# Altium schematic sheet Title Page.SchDoc: Title Page
size 431 x 279 mm; DocumentNumber: GHL-1-21002; Revision: C; SheetNumber: 1; SheetTotal: 7; ProjectID: 263-03
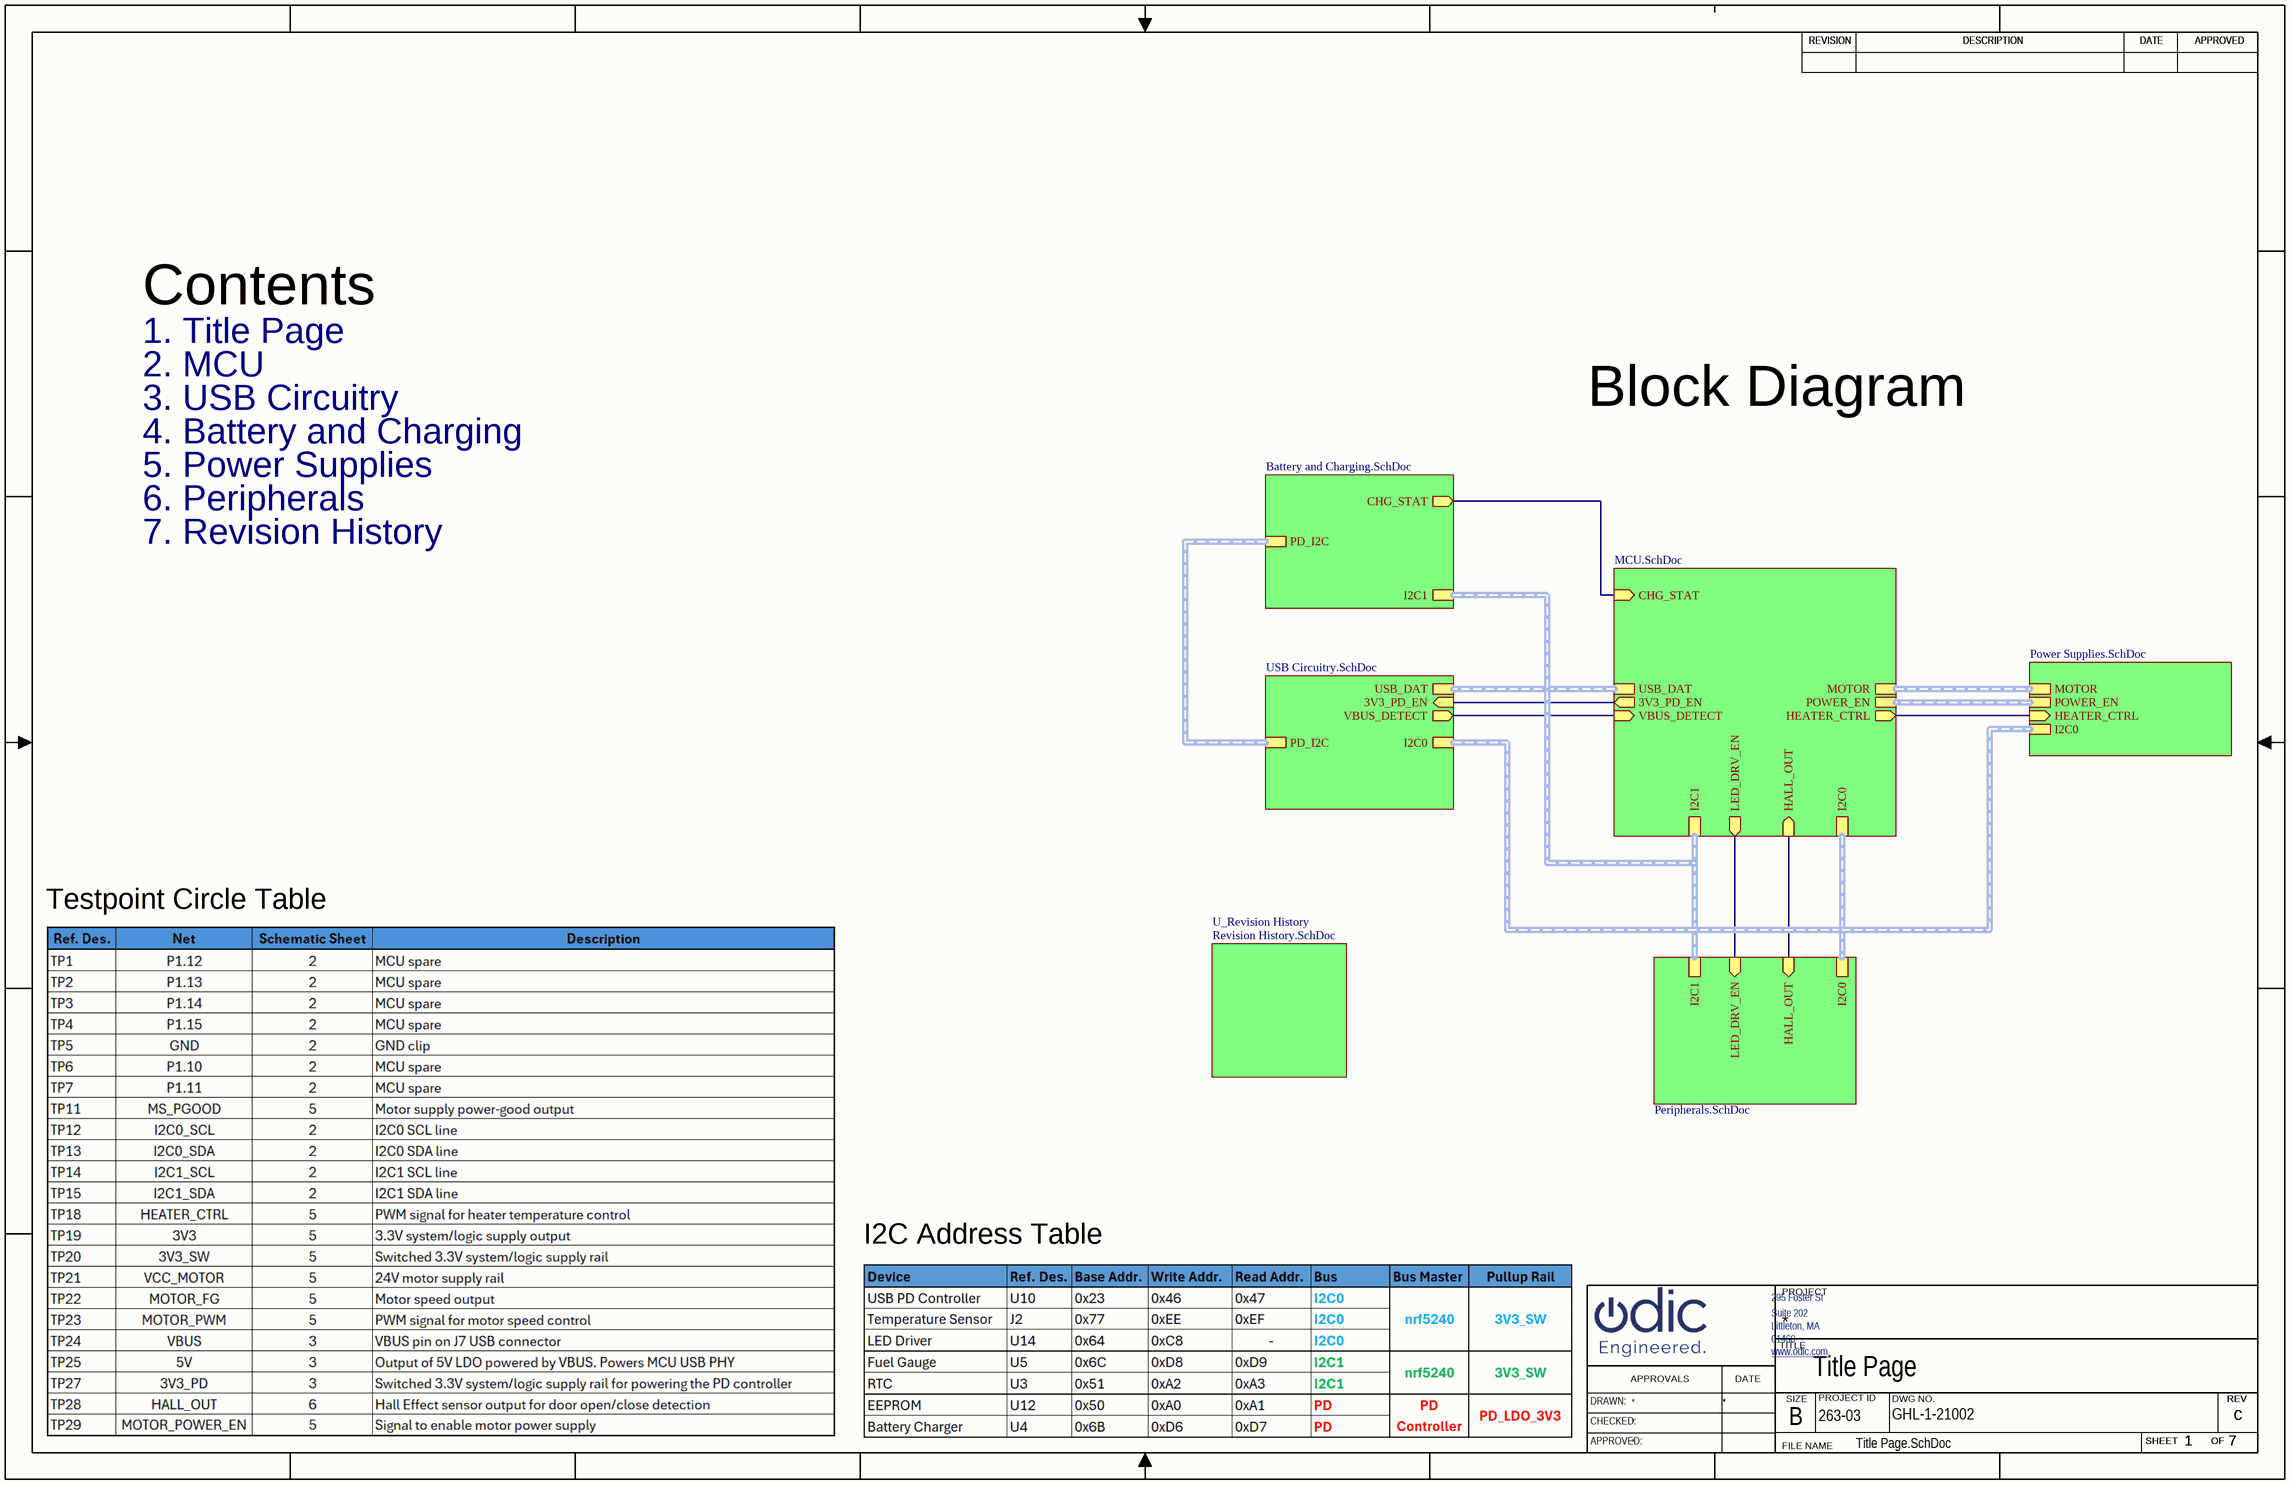
[diagram p0: Title Page.SchDoc]

## Sub-sheets
U_Battery and Charging = Battery and Charging.SchDoc: PD_I2C (harness I2C), I2C1 (harness I2C), CHG_STAT (out)
U_MCU = MCU.SchDoc: I2C0 (harness I2C), VBUS_DETECT (in), POWER_EN (harness Power Enables), LED_DRV_EN (out), 3V3_PD_EN (out), USB_DAT (harness USB_DAT), HALL_OUT (in), HEATER_CTRL (out), I2C1 (harness I2C), MOTOR (harness Motor), CHG_STAT (in)
U_Peripherals = Peripherals.SchDoc: I2C0 (harness I2C), LED_DRV_EN (in), I2C1 (harness I2C), HALL_OUT (in)
U_Power Supplies = Power Supplies.SchDoc: POWER_EN (harness Power Enables), I2C0 (harness I2C), HEATER_CTRL (in), MOTOR (harness Motor)
U_Revision History = Revision History.SchDoc: no entries
U_USB Circuitry = USB Circuitry.SchDoc: USB_DAT (harness USB_DAT), VBUS_DETECT (out), I2C0 (harness I2C), PD_I2C (harness I2C), 3V3_PD_EN (in)

## Nets
(unnamed): sheet U_MCU/VBUS_DETECT, sheet U_USB Circuitry/VBUS_DETECT
(unnamed): sheet U_MCU/LED_DRV_EN, sheet U_Peripherals/LED_DRV_EN
(unnamed): sheet U_MCU/3V3_PD_EN, sheet U_USB Circuitry/3V3_PD_EN
(unnamed): sheet U_MCU/HALL_OUT, sheet U_Peripherals/HALL_OUT
(unnamed): sheet U_MCU/HEATER_CTRL, sheet U_Power Supplies/HEATER_CTRL
(unnamed): sheet U_MCU/CHG_STAT, sheet U_Battery and Charging/CHG_STAT

## Buses and harness runs
harness sheet U_Battery and Charging/I2C1 = sheet U_MCU/I2C1 = sheet U_Peripherals/I2C1
harness sheet U_Battery and Charging/PD_I2C = sheet U_USB Circuitry/PD_I2C
harness sheet U_MCU/I2C0 = sheet U_Peripherals/I2C0 = sheet U_Power Supplies/I2C0 = sheet U_USB Circuitry/I2C0
harness sheet U_MCU/MOTOR = sheet U_Power Supplies/MOTOR
harness sheet U_MCU/POWER_EN = sheet U_Power Supplies/POWER_EN
harness sheet U_MCU/USB_DAT = sheet U_USB Circuitry/USB_DAT

## Notes on the sheet
- Contents
- 1. Title Page
- 2. MCU
- 3. USB Circuitry
- Block Diagram
- 4. Battery and Charging
- 5. Power Supplies
- 6. Peripherals
- 7. Revision History
- Testpoint Circle Table
- I2C Address Table
- REVISION
- DESCRIPTION
- DATE
- APPROVED
- 295 Foster St
- PROJECT
- www.odic.com <http://www.odic.com>
- Littleton, MA
- 01460
- Suite 202
- TITLE
- DRAWN:
- CHECKED:
- APPROVALS
- SIZE
- B
- PROJECT ID
- DWG NO.
- SHEET
- OF
- REV
- APPROVED:
- FILE NAME